# Altium schematic sheet CW308T_PIC24FJ.SchDoc: <Enter Sheet Title>
size Letter; Organization: NewAE Technology Inc.; Address1: 1083 Queen St., Suite 196; Address2: Halifax; Address3: NS; Address4: Canada B3H 0B2; SheetApproved: NO
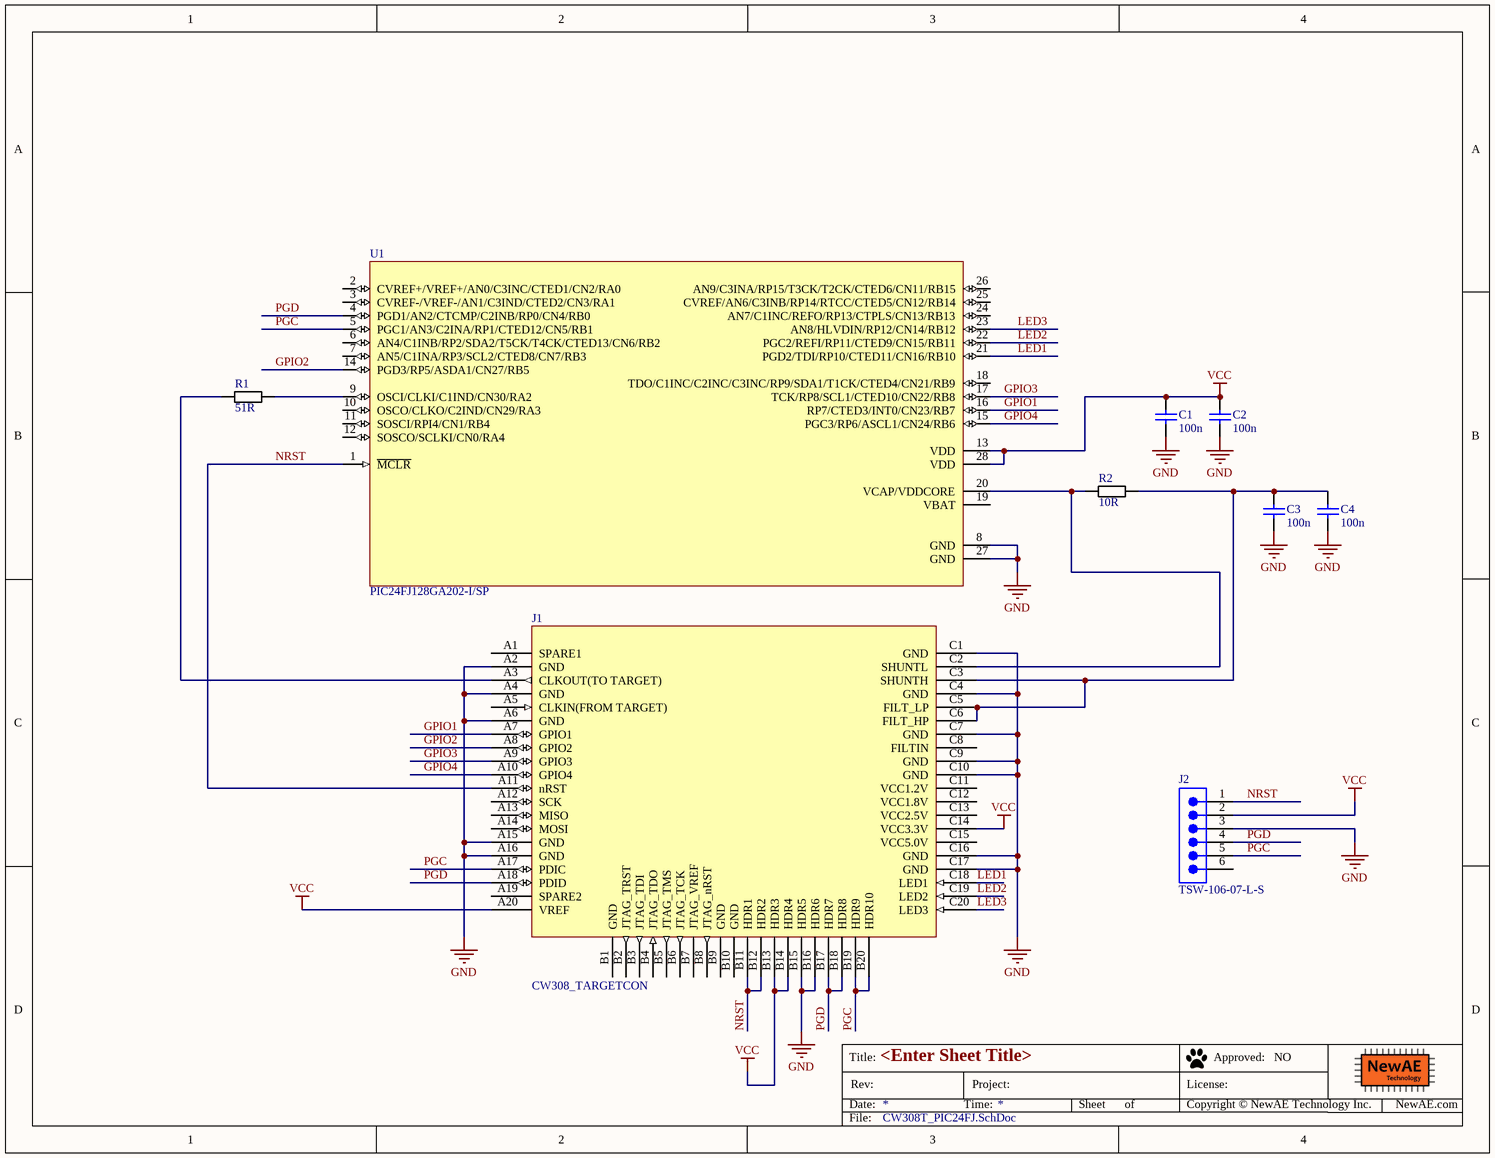
[diagram p0: CW308T_PIC24FJ.SchDoc]

## Parts
C1  100n  [CAPC0603_M]
C2  100n  [CAPC0603_M]
C3  100n  [CAPC0603_M]
C4  100n  [CAPC0603_M]
J1  CW308_TARGETCON  [CW308_TBOARD_CONN]
J2  TSW-106-07-L-S  [SMTC-TSW-106-07-X-S]
R1  51R  [RESC1608X55N]
R2  10R  [RESC1608X55N]
U1  PIC24FJ128GA202-I/SP  [DIP28]

## Nets
GND: C1.2 C2.2 C3.2 C4.2 J1.A2(GND) J1.A4(GND) J1.A6(GND) J1.A15(GND) J1.A16(GND) J1.B15(HDR5) J1.B16(HDR6) J1.C1(GND) J1.C4(GND) J1.C7(GND) J1.C9(GND) J1.C10(GND) J1.C16(GND) J1.C17(GND) J2.3 U1.8(GND) U1.27(GND)
VCC: C1.1 C2.1 J1.A20(VREF) J1.B13(HDR3) J1.B14(HDR4) J1.C14(VCC3.3V) J2.2 U1.13(VDD) U1.28(VDD)
GPIO1: J1.A7(GPIO1) U1.16(RP7/CTED3/INT0/CN23/RB7)
GPIO2: J1.A8(GPIO2) U1.14(PGD3/RP5/ASDA1/CN27/RB5)
GPIO3: J1.A9(GPIO3) U1.17(TCK/RP8/SCL1/CTED10/CN22/RB8)
GPIO4: J1.A10(GPIO4) U1.15(PGC3/RP6/ASCL1/CN24/RB6)
LED1: J1.C18(LED1) U1.21(PGD2/TDI/RP10/CTED11/CN16/RB10)
LED2: J1.C19(LED2) U1.22(PGC2/REFI/RP11/CTED9/CN15/RB11)
LED3: J1.C20(LED3) U1.23(AN8/HLVDIN/RP12/CN14/RB12)
NRST: J1.A11(nRST) J1.B11(HDR1) J1.B12(HDR2) J2.1 U1.1(~{MCLR})
PGC: J1.A17(PDIC) J1.B19(HDR9) J1.B20(HDR10) J2.5 U1.5(PGC1/AN3/C2INA/RP1/CTED12/CN5/RB1)
PGD: J1.A18(PDID) J1.B17(HDR7) J1.B18(HDR8) J2.4 U1.4(PGD1/AN2/CTCMP/C2INB/RP0/CN4/RB0)
NetC3_1: C3.1 C4.1 J1.C3(SHUNTH) J1.C5(FILT_LP) J1.C6(FILT_HP) R2.2
NetJ1_A3: J1.A3(CLKOUT(TO_TARGET)) R1.1
NetJ1_C2: J1.C2(SHUNTL) R2.1 U1.20(VCAP/VDDCORE)
NetR1_2: R1.2 U1.9(OSCI/CLKI/C1IND/CN30/RA2)

Not connected (* = marked no-connect by the designer): J1 A1(SPARE1) A5(CLKIN(FROM_TARGET)) A12(SCK) A13(MISO) A14(MOSI) A19(SPARE2) B1(GND) B2(JTAG_TRST) B3(JTAG_TDI) B4(JTAG_TDO) B5(JTAG_TMS) B6(JTAG_TCK) B7(JTAG_VREF) B8(JTAG_nRST) B9(GND) B10(GND) C8(FILTIN) C11(VCC1.2V) C12(VCC1.8V) C13(VCC2.5V) C15(VCC5.0V); J2 6; U1 2(CVREF+/VREF+/AN0/C3INC/CTED1/CN2/RA0) 3(CVREF-/VREF-/AN1/C3IND/CTED2/CN3/RA1) 6(AN4/C1INB/RP2/SDA2/T5CK/T4CK/CTED13/CN6/RB2) 7(AN5/C1INA/RP3/SCL2/CTED8/CN7/RB3) 10(OSCO/CLKO/C2IND/CN29/RA3) 11(SOSCI/RPI4/CN1/RB4) 12(SOSCO/SCLKI/CN0/RA4) 18(TDO/C1INC/C2INC/C3INC/RP9/SDA1/T1CK/CTED4/CN21/RB9) 19(VBAT) 24(AN7/C1INC/REFO/RP13/CTPLS/CN13/RB13) 25(CVREF/AN6/C3INB/RP14/RTCC/CTED5/CN12/RB14) 26(AN9/C3INA/RP15/T3CK/T2CK/CTED6/CN11/RB15)

## Notes on the sheet
- Title:
- Date:
- Rev:
- Time:
- Project:
- Sheet
- of
- License:
- Copyright © NewAE Technology Inc.
- Approved:
- NewAE.com
- File:

## Library data of the parts
C1-C4 = CCHIP-100n-0603: 100n, 0603; Component Group: Capacitor; Case-EIA: 0603; Case-Metric: 1608; Part Number: CCHIP-100n-0603; Footprint: 0603; Pin Count: 2; Value: 100n; Mounting Technology: SMT; Component Kind: Standard; Component Type: Standard
J1 = CW308_TBOARD: CW308 "Standard" Target Board Connector; Component Group: Mechanical; Pitch: 2.54mm; Part Number: CW308_TBOARD; Pin Count: 60; Mounting Technology: Through-hole; Component Kind: Standard; Component Type: Standard
J2 = CMP-1024-00386-1: Manufacturer: Samtec; Pitch: 2.54 mm; RoHS: True; PartNumber: TSW-106-07-L-S; Orientation: Vertical; PackageReference: TSW-106-07-X-S; PackageDescription: .025[0.64] SQ. Post Terminal Strip Assembly; DatasheetVersion: F-214; ComponentLink3Description: Package Specification; Mounting Technology: Through-hole; ComponentLink2Description: Datasheet; PackageVersion: DM, 8/1988; ComponentLink3URL: http://www.samtec.com/documents/webfiles/cpdf/TSW-XXX-XX-XXX-X-XX-XXX-MKT.pdf; Temperature Range: -55 to 125 degC; ComponentLink2URL: http://www.samtec.com/documents/webfiles/pdf/TSW_TH.PDF; ComponentLink1Description: Manufacturer URL; ComponentLink1URL: http://www.samtec.com
R1 = RCHIP-51R-0603: 51R res, 0603, 1%, 1/10W; Manufacture 1: Yageo; Manufacture Part Number 1: RC0603FR-0751RL; Component Group: Resistor; Case-EIA: 0603; Case-Metric: 1608; Rated Power: 0.1W; Rated Voltage: 75VDC; Part Number: RCHIP-51R-0603; Footprint: 0603; Pin Count: 2; Supplier 1: Digi-Key; Supplier Part Number 1: 311-51.0HRCT-ND; Value: 51R; Tolerance: 1%; Mounting Technology: SMT; Temperature Range: -55C to 155C; Component Kind: Standard; Component Type: Standard
R2 = RCHIP-10R-0603: 10R res, 0603, 1%, 1/10W; Manufacture 1: Yageo; Manufacture Part Number 1: RC0603FR-0710RL; Component Group: Resistor; Case-EIA: 0603; Case-Metric: 1608; Rated Power: 0.1W; Rated Voltage: 75VDC; Part Number: RCHIP-10R-0603; Footprint: 0603; Pin Count: 2; Supplier 1: Digi-Key; Supplier Part Number 1: 311-10.0HRCT-ND; Value: 10R; Tolerance: 1%; Mounting Technology: SMT; Temperature Range: -55C to 155C; Component Kind: Standard; Component Type: Standard
U1 = PIC24FJ128GA202-I/SP: PIC24FJ, Hardware AES; Manufacture 1: Microchip; Component Group: Digital IC; Part Number: PIC24FJ128GA202-I/SP; Footprint: DIP-28; Manufacture Part Number 1: PIC24FJ128GA202-I/SP; Pin Count: 44; Supplier 1: Digi-Key; Supplier Part Number 1: PIC24FJ128GA202-I/SP-ND; Mounting Technology: SMT; Component Kind: Standard; Component Type: Standard